# EAGLE design DDS9m-Controller (EAGLE 9.3.0)
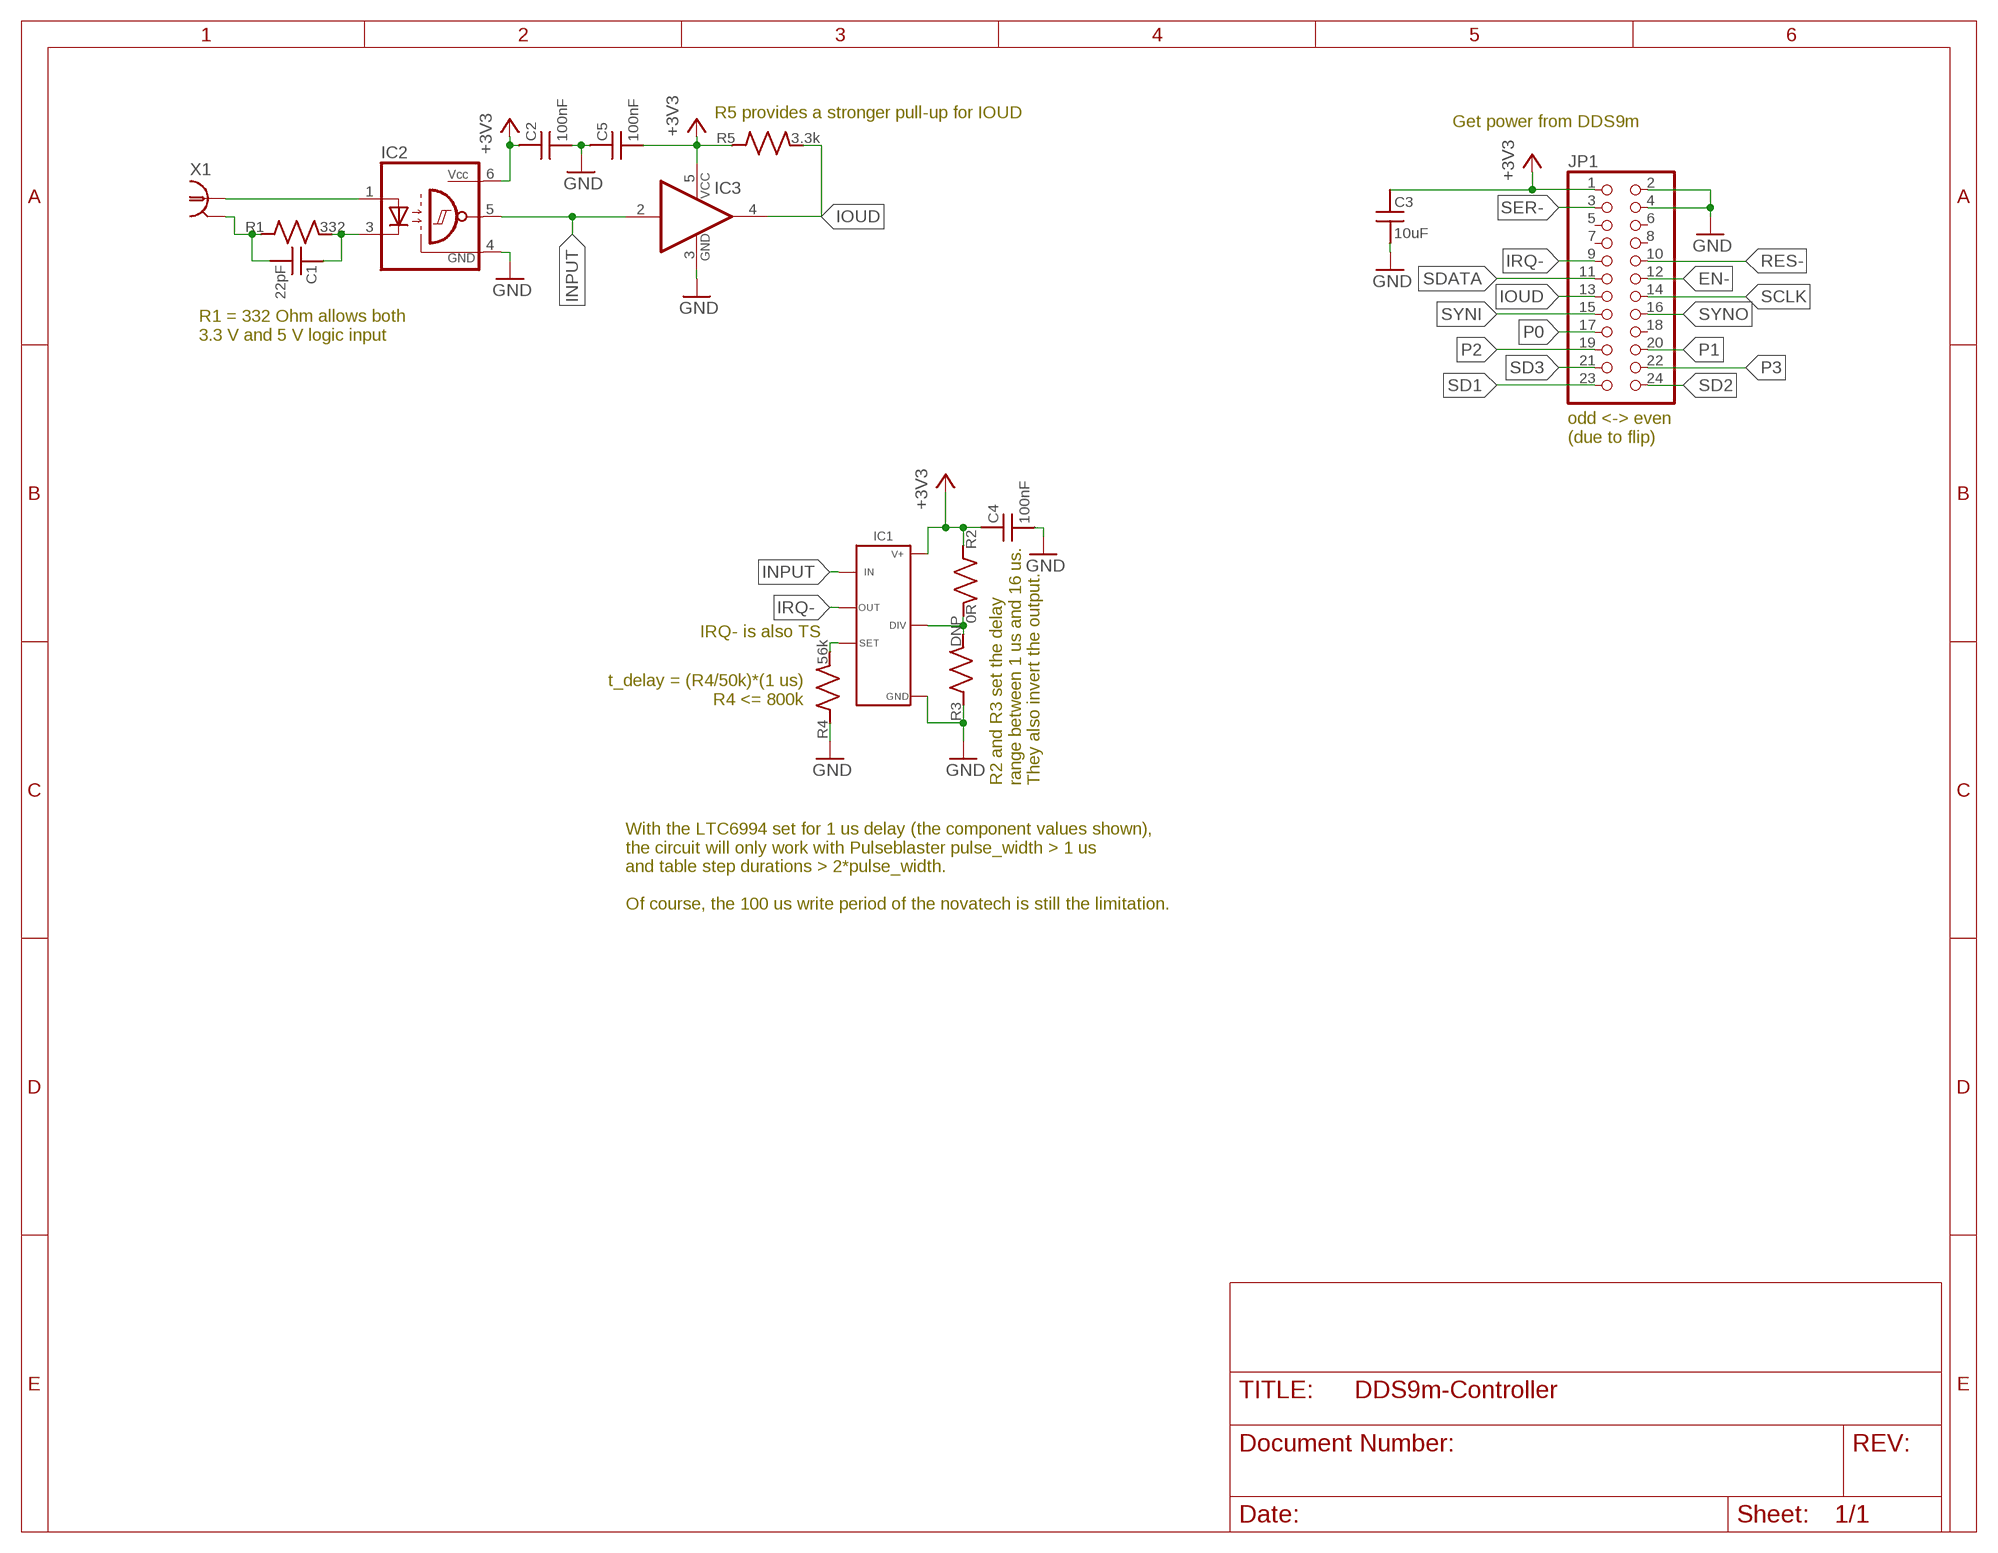
[diagram p0: schematic, sheet 1]

## Parts
C1  22pF  C_MLCC_SMDCMLCC_0402  [C_MLCC_0402]
C2  100nF  C_MLCC_SMDCMLCC_0603  [C_MLCC_0603]
C3  10uF  C_MLCC_SMDCMLCC_1210  [C_MLCC_1210]
C4  100nF  C_MLCC_SMDCMLCC_0603  [C_MLCC_0603]
C5  100nF  C_MLCC_SMDCMLCC_0603  [C_MLCC_0603]
IC1  LTC6994-X  [SOT23-6L]
IC2  TLP2767  [SO6L]
IC3  74LVC1G07DCK  [SC70-5]
JP1  PINHD-2X12  [2X12]
R1  332  R_SMDR0603  [R_0603]
R2  0R  R_SMDR0603  [R_0603]
R3  DNP  R_SMDR0603  [R_0603]
R4  56k  R_SMDR0603  [R_0603]
R5  3.3k  R_SMDR0603  [R_0603]
X1  BNC-V  [BNC-V]

## Nets
+3V3: C2.P$1 C3.P$1 C4.P$1 C5.P$2 IC1.5(V+) IC2.6(VCC) IC3.5(VCC) JP1.1 R2.P$1 R5.P$1
EN-: JP1.12
GND: C2.P$2 C3.P$2 C4.P$2 C5.P$1 IC1.2(GND) IC2.4(GND) IC3.3(GND) JP1.2 JP1.4 R3.P$1 R4.P$1
INPUT: IC1.1(IN) IC2.5(OUT) IC3.2(I)
IOUD: IC3.4(O) JP1.13 R5.P$2
IRQ-: IC1.6(OUT) JP1.9
N$1: C1.P$1 IC2.3(C) R1.P$2
N$2: C1.P$2 R1.P$1 X1.2
N$3: IC2.1(A) X1.1
N$4: IC1.4(DIV) R2.P$2 R3.P$2
N$6: IC1.3(SET) R4.P$2
P0: JP1.17
P1: JP1.20
P2: JP1.19
P3: JP1.22
RES-: JP1.10
SCLK: JP1.14
SD1: JP1.23
SD2: JP1.24
SD3: JP1.21
SDATA: JP1.11
SER-: JP1.3
SYNI: JP1.15
SYNO: JP1.16
Unconnected: JP1.5 JP1.6 JP1.7 JP1.8 JP1.18

## Notes on the sheet
- R5 provides a stronger pull-up for IOUD
- Get power from DDS9m
- R1 = 332 Ohm allows both
  3.3 V and 5 V logic input
- odd <-> even
  (due to flip)
- IRQ- is also TS
- t_delay = (R4/50k)*(1 us)
  R4 <= 800k
- R2 and R3 set the delay
  range between 1 us and 16 us.
  They also invert the output.
- With the LTC6994 set for 1 us delay (the component values shown),
  the circuit will only work with Pulseblaster pulse_width > 1 us
  and table step durations > 2*pulse_width.
  
  Of course, the 100 us write period of the novatech is still the limitation.

## Library data of the parts
C1 = jqi_passives:C_MLCC_SMD; PARTNO: CL05C220JB51PNC
C2 C4 C5 = jqi_passives:C_MLCC_SMD; PARTNO: CL10B104KB8NNNC
C3 = jqi_passives:C_MLCC_SMD; PARTNO: CL32B106KLJNNNE
IC1 = linear-technology-jqi:LTC6994-X: LTC6994, programmable delay line/debouncer.; PARTNO: LTC6994IS6-2#TRMPBF
IC2 = optocoupler-jqi:TLP2767: TLP2767 50 Mbd, Inverting Optocoupler.; PARTNO: TLP2767(TP,E
IC3 = 74xx-little-us:74*1G07: Single Buffer/Driver With Open-Drain Output; PARTNO: SN74LVC1G07DCKR
JP1 = pinhead:PINHD-2X12: PIN HEADER; PARTNO: PPPC122LFBN-RC
R1 = jqi_passives:R_SMD; PARTNO: ERJ-3EKF3320V
R2 = jqi_passives:R_SMD; PARTNO: MF-RES-0603-0
R3 = jqi_passives:R_SMD
R4 = jqi_passives:R_SMD; PARTNO: ERA-3AEB563V
R5 = jqi_passives:R_SMD; PARTNO: ERJ-3EKF3301V
X1 = connector-jqi:BNC: BNC Connector.; PARTNO: 5227222-3

## Board
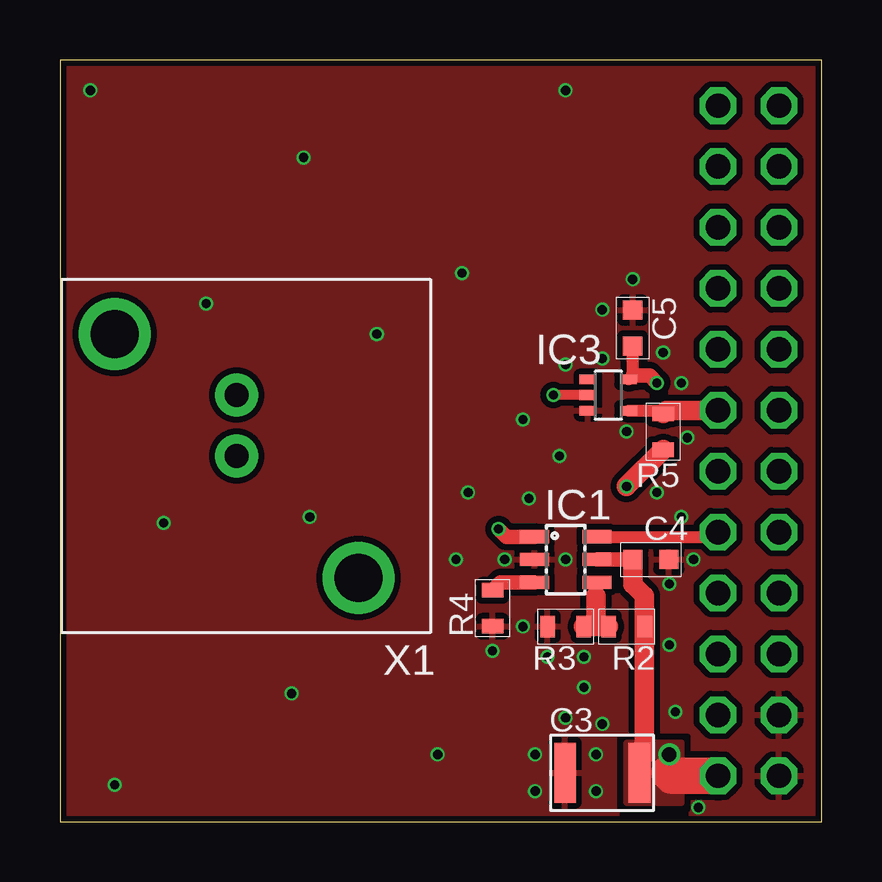
[diagram p1: board, top side]
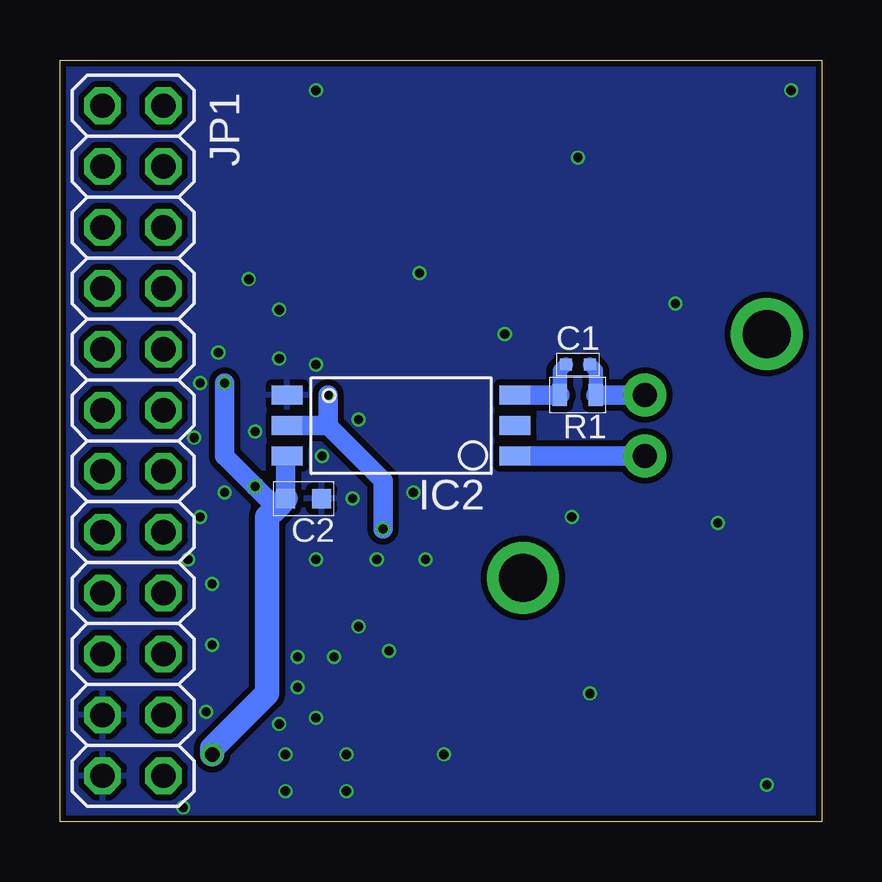
[diagram p2: board, bottom side, seen from below]

Size 31.75 x 31.75 mm. Coordinates in mm from the lower left corner, seen from the top.
Outline: 0,0 31.75,0 31.75,31.75 0,31.75 0,0
Copper layers (1*16): Top 0.035mm / dielectric 1.5mm / Bottom 0.035mm
Design rules "MF_Standard_2_Layer": minimum track width 5mil, minimum drill 10mil, track to track 5mil, track to pad 5mil, pad to pad 5mil, via to via 5mil, smd to smd 0mil, copper to edge 10mil, drill to drill 10mil, minimum pad ring 4mil, minimum via ring 4mil, stop-mask expansion 2mil, vias tented up to drill 25mil, thermal gap 10mil

### Footprints (pad centres in the part's own frame; a part is rotated, then mirrored left to right if it is on the bottom)
C_MLCC_0402 = smd 0.5 x 0.5: P$1 -0.5,0; P$2 0.5,0
C_MLCC_0603 = smd 0.8 x 0.8: P$1 -0.75,0; P$2 0.75,0
C_MLCC_1210 = smd 0.9 x 2.5: P$1 -1.55,0; P$2 1.55,0
SOT23-6L = smd 0.55 x 1.2: 1 -0.95,-1.3; 2 0,-1.3; 3 0.95,-1.3; 4 0.95,1.3; 5 0,1.3; 6 -0.95,1.3
SO6L = smd 1.3 x 0.8: 1 -4.75,1.27; 2 -4.75,0; 3 -4.75,-1.27; 4 4.75,-1.27; 5 4.75,0; 6 4.75,1.27
SC70-5 = smd 0.4 x 0.7: 1 -0.65,-0.85; 2 0,-0.85; 3 0.65,-0.85; 4 0.65,0.85; 5 -0.65,0.85
2X12 = drill 1.016 octagon: 1 -13.97,-1.27; 2 -13.97,1.27; 3 -11.43,-1.27; 4 -11.43,1.27; 5 -8.89,-1.27; 6 -8.89,1.27; 7 -6.35,-1.27; 8 -6.35,1.27; 9 -3.81,-1.27; 10 -3.81,1.27; 11 -1.27,-1.27; 12 -1.27,1.27; 13 1.27,-1.27; 14 1.27,1.27; 15 3.81,-1.27; 16 3.81,1.27; 17 6.35,-1.27; 18 6.35,1.27; 19 8.89,-1.27; 20 8.89,1.27; 21 11.43,-1.27; 22 11.43,1.27; 23 13.97,-1.27; 24 13.97,1.27
R_0603 = smd 0.6 x 0.9: P$1 -0.75,0; P$2 0.75,0
BNC-V = drill 1 pad 1.778: 1 0,0; 2 -2.54,0 | drill 2 pad 2.032: ANCHOR1 -5.08,-5.08; ANCHOR2 5.08,5.08

### Placement (x,y rotation side)
C1  10.16,19.05 0 bottom
C2  21.59,13.46 0 bottom
C3  22.61,2.03 180 top
C4  24.64,10.92 0 top
C5  23.88,20.57 270 top
IC1  21.08,10.92 270 top
IC2  17.53,16.51 180 bottom
IC3  22.86,17.78 270 top
JP1  28.7,15.88 90 bottom
R1  10.16,17.78 180 bottom
R2  23.62,8.13 180 top
R3  21.08,8.13 0 top
R4  18.03,8.89 90 top
R5  25.15,16.26 90 top
X1  7.37,15.24 270 top

### Tracks (layer width: path | path; a pad name or v marks a point on that pad's centre or on a via)
+3V3  (via drill 0.38, 0.61)
  Top 0.508: IC3.5 23.88,18.6 C5.P$2
  Top 0.61: IC1.5 C4.P$1 | v24.89,18.29 24.58,18.6 23.88,18.6
  Top 0.813: C4.P$1 23.89,9.89 24.37,9.41 R2.P$1 24.37,2.81 24.38,2.79 | R5.P$1 23.62,13.98 v23.62,13.97
  Top 1.524: JP1.1 25.53,1.91 25.4,2.03
  Bottom 0.813: IC2.6 22.34,15.18 C2.P$1 | 22.73,13.07 v23.62,13.97 24.89,15.24 v24.89,18.29
  Bottom 1.016: C2.P$1 22.73,13.07 23.11,12.69 23.11,5.33 25.4,3.05 v25.4,2.79
  pour Top (isolate 0.254, rank 5, no thermals): 25.91,0.76 23.62,0.76 23.62,3.3 25.91,3.3
GND  (via drill 0.38)
  other vias: 18.03,7.11 19.3,8.13 20.32,6.86 25.4,9.91 19.81,2.79 19.81,1.27 21.08,4.32 22.35,2.79 22.35,1.27 19.56,13.46 23.88,22.61 21.08,19.05 22.61,19.3 26.42,10.92 25.65,4.57 26.62,0.58 21.84,5.59 23.62,16.26 24.89,13.72 25.91,18.29 26.16,16 25.15,19.56 25.91,12.7 25.4,7.37 22.61,4.06 21.84,6.86 21.08,10.92 18.54,10.92 20.83,15.24 19.3,16.76 17.02,13.72 16.51,10.92 22.61,21.34 1.27,30.48 2.29,1.52 9.65,5.33 4.32,12.45 6.1,21.59 10.16,27.69 21.08,30.48 16.76,22.86 13.21,20.32 10.41,12.7 15.75,2.79
  pour Top (isolate 0.254, rank 6): 0,0 31.75,0 31.75,31.75 0,31.75
  pour Bottom (isolate 0.254, rank 6): 0,0 31.75,0 31.75,31.75 0,31.75
INPUT  (via drill 0.38)
  Top 0.406: IC3.2 v20.57,17.78
  Top 0.61: IC1.1 18.61,11.87 v18.29,12.19
  Bottom 0.813: IC2.5 20.57,16.51 | 20.57,16.51 18.29,14.22 v18.29,12.19 | v20.57,17.78 20.57,16.51
IOUD
  Top 0.508: IC3.4 25.02,17.13 R5.P$2
  Top 0.813: R5.P$2 25.29,17.14 JP1.13
IRQ-
  Top 0.508: IC1.6 27.24,11.87 JP1.9
N$1
  Bottom 0.61: R1.P$2 10.91,18.8 C1.P$1
  Bottom 0.813: R1.P$2 IC2.3
N$2
  Bottom 0.61: R1.P$1 9.41,18.8 C1.P$2
  Bottom 0.813: R1.P$1 X1.2
N$3
  Bottom 0.813: IC2.1 X1.1
N$4
  Top 0.508: IC1.4 22.35,9.94 22.35,9.4
  Top 0.813: R2.P$2 22.35,8.13 | 22.35,8.13 R3.P$2 | 22.35,9.4 22.35,8.13
N$6
  Top 0.61: IC1.3 18.37,9.97 R4.P$2